# Altium schematic sheet 05_Inputs_28-35.SchDoc
size 594 x 420 mm; DocumentNumber: Входы сухой контакт; SheetNumber: 5; SheetTotal: 6
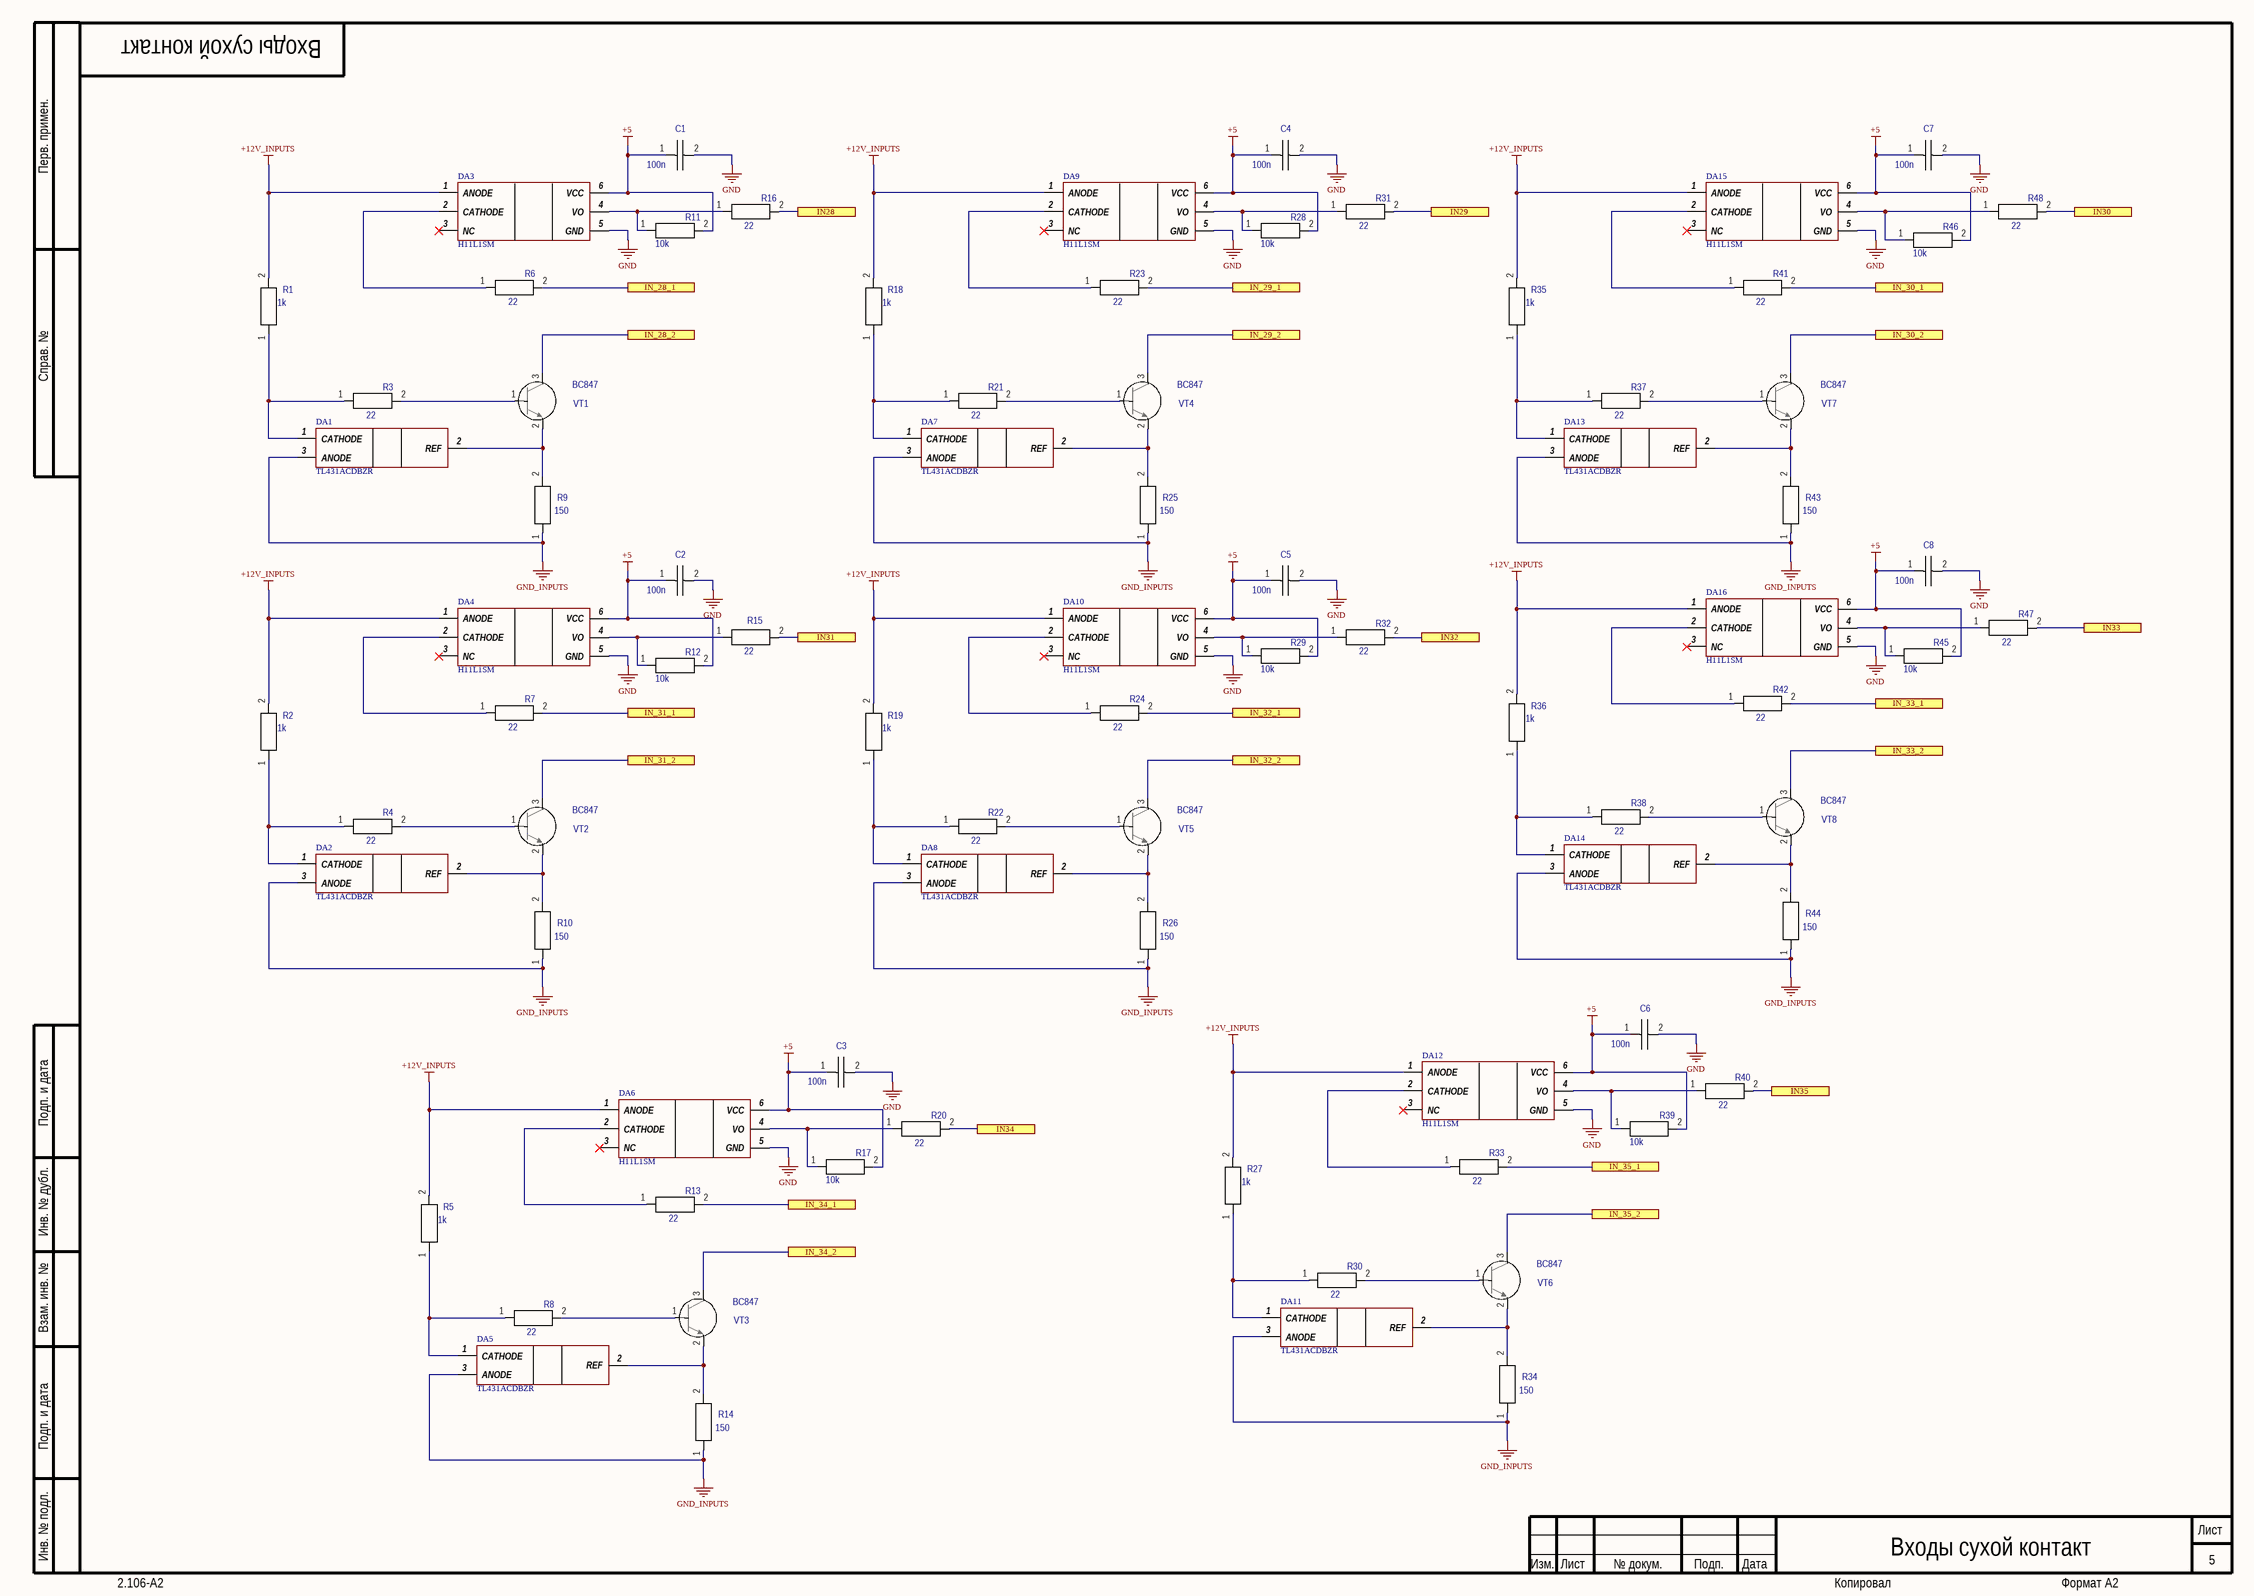
[diagram p0: 05_Inputs_28-35.SchDoc]

## Parts
C1  value 100n  [C0603]  (hidden comment: C0603)
C2  value 100n  [C0603]  (hidden comment: C0603)
C3  value 100n  [C0603]  (hidden comment: C0603)
C4  value 100n  [C0603]  (hidden comment: C0603)
C5  value 100n  [C0603]  (hidden comment: C0603)
C6  value 100n  [C0603]  (hidden comment: C0603)
C7  value 100n  [C0603]  (hidden comment: C0603)
C8  value 100n  [C0603]  (hidden comment: C0603)
DA1  TL431ACDBZR  [SOT95P237X112-3N]
DA2  TL431ACDBZR  [SOT95P237X112-3N]
DA3  H11L1SM  [SOP254P1030X460-6N]
DA4  H11L1SM  [SOP254P1030X460-6N]
DA5  TL431ACDBZR  [SOT95P237X112-3N]
DA6  H11L1SM  [SOP254P1030X460-6N]
DA7  TL431ACDBZR  [SOT95P237X112-3N]
DA8  TL431ACDBZR  [SOT95P237X112-3N]
DA9  H11L1SM  [SOP254P1030X460-6N]
DA10  H11L1SM  [SOP254P1030X460-6N]
DA11  TL431ACDBZR  [SOT95P237X112-3N]
DA12  H11L1SM  [SOP254P1030X460-6N]
DA13  TL431ACDBZR  [SOT95P237X112-3N]
DA14  TL431ACDBZR  [SOT95P237X112-3N]
DA15  H11L1SM  [SOP254P1030X460-6N]
DA16  H11L1SM  [SOP254P1030X460-6N]
R1  value 1k  [RESC1608N]  (hidden comment: R0603)
R2  value 1k  [RESC1608N]  (hidden comment: R0603)
R3  value 22  [RESC1608N]  (hidden comment: R0603)
R4  value 22  [RESC1608N]  (hidden comment: R0603)
R5  value 1k  [RESC1608N]  (hidden comment: R0603)
R6  value 22  [RESC1608N]  (hidden comment: R0603)
R7  value 22  [RESC1608N]  (hidden comment: R0603)
R8  value 22  [RESC1608N]  (hidden comment: R0603)
R9  value 150  [RESC1608N]  (hidden comment: R0603)
R10  value 150  [RESC1608N]  (hidden comment: R0603)
R11  value 10k  [RESC1608N]  (hidden comment: R0603)
R12  value 10k  [RESC1608N]  (hidden comment: R0603)
R13  value 22  [RESC1608N]  (hidden comment: R0603)
R14  value 150  [RESC1608N]  (hidden comment: R0603)
R15  value 22  [RESC1608N]  (hidden comment: R0603)
R16  value 22  [RESC1608N]  (hidden comment: R0603)
R17  value 10k  [RESC1608N]  (hidden comment: R0603)
R18  value 1k  [RESC1608N]  (hidden comment: R0603)
R19  value 1k  [RESC1608N]  (hidden comment: R0603)
R20  value 22  [RESC1608N]  (hidden comment: R0603)
R21  value 22  [RESC1608N]  (hidden comment: R0603)
R22  value 22  [RESC1608N]  (hidden comment: R0603)
R23  value 22  [RESC1608N]  (hidden comment: R0603)
R24  value 22  [RESC1608N]  (hidden comment: R0603)
R25  value 150  [RESC1608N]  (hidden comment: R0603)
R26  value 150  [RESC1608N]  (hidden comment: R0603)
R27  value 1k  [RESC1608N]  (hidden comment: R0603)
R28  value 10k  [RESC1608N]  (hidden comment: R0603)
R29  value 10k  [RESC1608N]  (hidden comment: R0603)
R30  value 22  [RESC1608N]  (hidden comment: R0603)
R31  value 22  [RESC1608N]  (hidden comment: R0603)
R32  value 22  [RESC1608N]  (hidden comment: R0603)
R33  value 22  [RESC1608N]  (hidden comment: R0603)
R34  value 150  [RESC1608N]  (hidden comment: R0603)
R35  value 1k  [RESC1608N]  (hidden comment: R0603)
R36  value 1k  [RESC1608N]  (hidden comment: R0603)
R37  value 22  [RESC1608N]  (hidden comment: R0603)
R38  value 22  [RESC1608N]  (hidden comment: R0603)
R39  value 10k  [RESC1608N]  (hidden comment: R0603)
R40  value 22  [RESC1608N]  (hidden comment: R0603)
R41  value 22  [RESC1608N]  (hidden comment: R0603)
R42  value 22  [RESC1608N]  (hidden comment: R0603)
R43  value 150  [RESC1608N]  (hidden comment: R0603)
R44  value 150  [RESC1608N]  (hidden comment: R0603)
R45  value 10k  [RESC1608N]  (hidden comment: R0603)
R46  value 10k  [RESC1608N]  (hidden comment: R0603)
R47  value 22  [RESC1608N]  (hidden comment: R0603)
R48  value 22  [RESC1608N]  (hidden comment: R0603)
VT1  BC847  [SOT23-3N]
VT2  BC847  [SOT23-3N]
VT3  BC847  [SOT23-3N]
VT4  BC847  [SOT23-3N]
VT5  BC847  [SOT23-3N]
VT6  BC847  [SOT23-3N]
VT7  BC847  [SOT23-3N]
VT8  BC847  [SOT23-3N]

## Ports
IN28, IN29, IN30, IN31, IN32, IN33, IN34, IN35, IN_28_1, IN_28_2, IN_29_1, IN_29_2, IN_30_1, IN_30_2, IN_31_1, IN_31_2, IN_32_1, IN_32_2, IN_33_1, IN_33_2, IN_34_1, IN_34_2, IN_35_1, IN_35_2

## Nets
+5: C1.1 C2.1 C3.1 C4.1 C5.1 C6.1 C7.1 C8.1 DA3.6(VCC) DA4.6(VCC) DA6.6(VCC) DA9.6(VCC) DA10.6(VCC) DA12.6(VCC) DA15.6(VCC) DA16.6(VCC) R11.2 R12.2 R17.2 R28.2 R29.2 R39.2 R45.2 R46.2
+12V_INPUTS: DA3.1(ANODE) DA4.1(ANODE) DA6.1(ANODE) DA9.1(ANODE) DA10.1(ANODE) DA12.1(ANODE) DA15.1(ANODE) DA16.1(ANODE) R1.2 R2.2 R5.2 R18.2 R19.2 R27.2 R35.2 R36.2
GND: C1.2 C2.2 C3.2 C4.2 C5.2 C6.2 C7.2 C8.2 DA3.5(GND) DA4.5(GND) DA6.5(GND) DA9.5(GND) DA10.5(GND) DA12.5(GND) DA15.5(GND) DA16.5(GND)
GND_INPUTS: DA1.3(ANODE) DA2.3(ANODE) DA5.3(ANODE) DA7.3(ANODE) DA8.3(ANODE) DA11.3(ANODE) DA13.3(ANODE) DA14.3(ANODE) R9.1 R10.1 R14.1 R25.1 R26.1 R34.1 R43.1 R44.1
IN28: R16.2 ; port IN28
IN29: R31.2 ; port IN29
IN30: R48.2 ; port IN30
IN31: R15.2 ; port IN31
IN32: R32.2 ; port IN32
IN33: R47.2 ; port IN33
IN34: R20.2 ; port IN34
IN35: R40.2 ; port IN35
IN_28_1: R6.2 ; port IN_28_1
IN_28_2: VT1.3 ; port IN_28_2
IN_29_1: R23.2 ; port IN_29_1
IN_29_2: VT4.3 ; port IN_29_2
IN_30_1: R41.2 ; port IN_30_1
IN_30_2: VT7.3 ; port IN_30_2
IN_31_1: R7.2 ; port IN_31_1
IN_31_2: VT2.3 ; port IN_31_2
IN_32_1: R24.2 ; port IN_32_1
IN_32_2: VT5.3 ; port IN_32_2
IN_33_1: R42.2 ; port IN_33_1
IN_33_2: VT8.3 ; port IN_33_2
IN_34_1: R13.2 ; port IN_34_1
IN_34_2: VT3.3 ; port IN_34_2
IN_35_1: R33.2 ; port IN_35_1
IN_35_2: VT6.3 ; port IN_35_2
NetDA1_1: DA1.1(CATHODE) R1.1 R3.1
NetDA1_2: DA1.2(REF) R9.2 VT1.2
NetDA2_1: DA2.1(CATHODE) R2.1 R4.1
NetDA2_2: DA2.2(REF) R10.2 VT2.2
NetDA3_2: DA3.2(CATHODE) R6.1
NetDA3_4: DA3.4(VO) R11.1 R16.1
NetDA4_2: DA4.2(CATHODE) R7.1
NetDA4_4: DA4.4(VO) R12.1 R15.1
NetDA5_1: DA5.1(CATHODE) R5.1 R8.1
NetDA5_2: DA5.2(REF) R14.2 VT3.2
NetDA6_2: DA6.2(CATHODE) R13.1
NetDA6_4: DA6.4(VO) R17.1 R20.1
NetDA7_1: DA7.1(CATHODE) R18.1 R21.1
NetDA7_2: DA7.2(REF) R25.2 VT4.2
NetDA8_1: DA8.1(CATHODE) R19.1 R22.1
NetDA8_2: DA8.2(REF) R26.2 VT5.2
NetDA9_2: DA9.2(CATHODE) R23.1
NetDA9_4: DA9.4(VO) R28.1 R31.1
NetDA10_2: DA10.2(CATHODE) R24.1
NetDA10_4: DA10.4(VO) R29.1 R32.1
NetDA11_1: DA11.1(CATHODE) R27.1 R30.1
NetDA11_2: DA11.2(REF) R34.2 VT6.2
NetDA12_2: DA12.2(CATHODE) R33.1
NetDA12_4: DA12.4(VO) R39.1 R40.1
NetDA13_1: DA13.1(CATHODE) R35.1 R37.1
NetDA13_2: DA13.2(REF) R43.2 VT7.2
NetDA14_1: DA14.1(CATHODE) R36.1 R38.1
NetDA14_2: DA14.2(REF) R44.2 VT8.2
NetDA15_2: DA15.2(CATHODE) R41.1
NetDA15_4: DA15.4(VO) R46.1 R48.1
NetDA16_2: DA16.2(CATHODE) R42.1
NetDA16_4: DA16.4(VO) R45.1 R47.1
NetR3_2: R3.2 VT1.1
NetR4_2: R4.2 VT2.1
NetR8_2: R8.2 VT3.1
NetR21_2: R21.2 VT4.1
NetR22_2: R22.2 VT5.1
NetR30_2: R30.2 VT6.1
NetR37_2: R37.2 VT7.1
NetR38_2: R38.2 VT8.1

Not connected (* = marked no-connect by the designer): DA3 3(NC)*; DA4 3(NC)*; DA6 3(NC)*; DA9 3(NC)*; DA10 3(NC)*; DA12 3(NC)*; DA15 3(NC)*; DA16 3(NC)*

## Notes on the sheet
- Перв. примен.
- Справ. №
- Подп. и дата
- Инв. № дубл.
- Взам. инв. №
- Инв. № подл.
- Изм.
- Лист
- № докум.
- Подп.
- Дата
- 2.106-A2
- Копировал
- Формат А2

## Library data of the parts
C1-C8 = GRM188R71C104KA01D: Manufacturer: Murata Manufacturing; Код: 22; ID: Конденсатор; Power/Voltage: 16V; Tolerance: ±10%; TKE: X7R; iii: Конденсатор GRM188R71C104KA01D 100n 16V ±10% C0603 X7R  Murata Manufacturing; Comments: C0603; Part Number: GRM188R71C104KA01D; Height: 0.9; Package: C0603; TemperatureMin: -55; TemperatureMax: 125
DA1 DA2 DA5 DA7 DA8 DA11 DA13 DA14 = TL431ACDBZR: Integrated Circuit; Manufacturer_Name: Texas Instruments; Datasheet Link: https://datasheet.datasheetarchive.com/originals/distributors/SFDatasheet-6/sf-000131849.pdf; Manufacturer_Part_Number: TL431ACDBZR; Mouser Part Number: 595-TL431ACDBZR; Mouser Price/Stock: https://www.mouser.co.uk/ProductDetail/Texas-Instruments/TL431ACDBZR?qs=odmYgEirbwzMcBuFx%2Fo8hQ%3D%3D; Arrow Part Number: TL431ACDBZR; Arrow Price/Stock: https://www.arrow.com/en/products/tl431acdbzr/texas-instruments?region=nac; PartNumber: TL431ACDBZR
DA3 DA4 DA6 DA9 DA10 DA12 DA15 DA16 = H11L1SM: Integrated Circuit; Manufacturer_Name: Iso Com; Datasheet Link: http://isocom.com/wp-content/uploads/2017/09/DD93224-H11L1_H11L1V-110817.pdf; Height: 4.6mm; Manufacturer_Part_Number: H11L1SM; PartNumber: H11L1SM
R1 R2 R5 R18 R19 R27 R35 R36 = RC0603FK-071KL: Manufacturer: Тайвань; Код: 31; ID: Резистор; Power/Voltage: 0.063W/50V; Tolerance: ±1%; iii: Резистор RC0603FK-071KL 1k 0.063W/50V ±1% R0603  Тайвань; Comments: R0603; Part Number: RC0603FK-071KL; Package: R0603; TemperatureMin: -55; TemperatureMax: 155
R3 R4 R6-R8 R13 R15 R16 R20-R24 R30-R33 R37 R38 R40-R42 R47 R48 = RC0603FK-0722RL: Manufacturer: Тайвань; Код: 11; ID: Резистор; Power/Voltage: 0.063W/50V; Tolerance: ±1%; iii: Резистор RC0603FK-0722RL 22 0.063W/50V ±1% R0603  Тайвань; Comments: R0603; Part Number: RC0603FK-0722RL; Package: R0603; TemperatureMin: -55; TemperatureMax: 155
R9 R10 R14 R25 R26 R34 R43 R44 = RC0603FK-07150RL: Manufacturer: Тайвань; Код: 17; ID: Резистор; Power/Voltage: 0.063W/50V; Tolerance: ±1%; iii: Резистор RC0603FK-07150RL 150 0.063W/50V ±1% R0603  Тайвань; Comments: R0603; Part Number: RC0603FK-07150RL; Package: R0603; TemperatureMin: -55; TemperatureMax: 155
R11 R12 R17 R28 R29 R39 R45 R46 = RC0603FK-0710KL: Part Number: RC0603FR-0710KL; Manufacturer: Тайвань; Код: 26; ID: Резистор; Power/Voltage: 0.063W/50V; Tolerance: ±1%; iii: Резистор RC0603FK-0710KL 10k 0.063W/50V ±1% R0603  Тайвань; Comments: R0603; Package: R0603; TemperatureMin: -55; TemperatureMax: 155
VT1-VT8 = BC847: Manufacturer: NXP Semiconductor; Код: 2; ID: Транзистор; Value: 0.1A; Power/Voltage: 45V; iii: Транзистор BC847 0.1A 45V  sot23  NXP Semiconductor; Com: BC847; Part Number: BC847; Package: sot23